# Altium schematic sheet MCU.SchDoc
size Letter
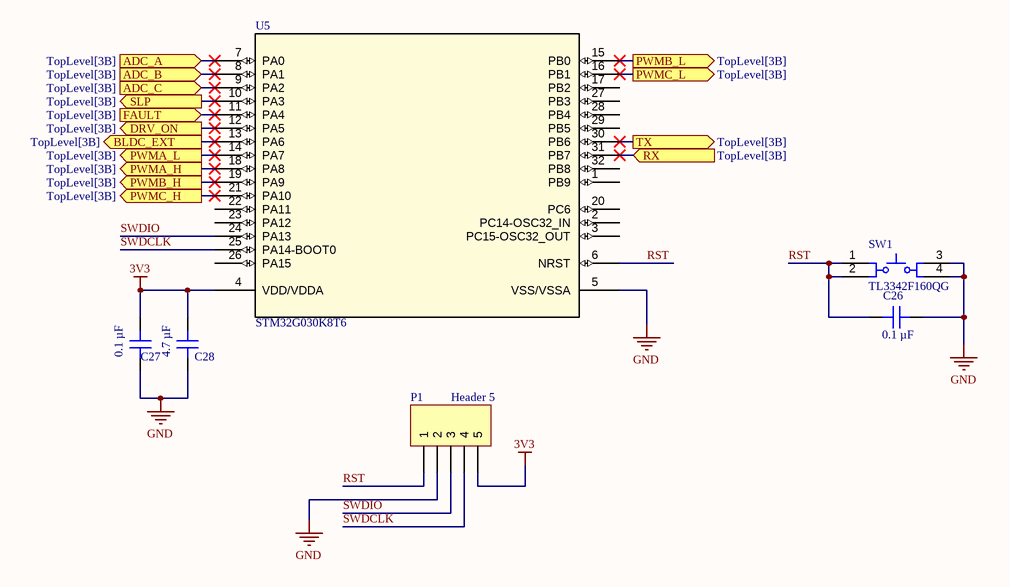
[diagram p0: MCU.SchDoc]

## Parts
C26  0.1 µF  [CAP 0805_2012]
C27  0.1 µF  [CAP 0805_2012]
C28  4.7 µF  [CAP 0805_2012]
P1  Header 5  [HDR1X5]
SW1  TL3342F160QG  [ESWI-TL3342F160QG_V]
U5  STM32G030K8T6  [LQFP-32]

## Ports
ADC_A (in, see TopLevel[3B]), ADC_B (in, see TopLevel[3B]), ADC_C (in, see TopLevel[3B]), BLDC_EXT (out, see TopLevel[3B]), DRV_ON (out, see TopLevel[3B]), FAULT (in, see TopLevel[3B]), PWMA_H (out, see TopLevel[3B]), PWMA_L (out, see TopLevel[3B]), PWMB_H (out, see TopLevel[3B]), PWMB_L (out, see TopLevel[3B]), PWMC_H (out, see TopLevel[3B]), PWMC_L (out, see TopLevel[3B]), RX (in, see TopLevel[3B]), SLP (out, see TopLevel[3B]), TX (out, see TopLevel[3B])

## Nets
3V3: C27.2 C28.2 P1.5 U5.4(VDD/VDDA)
GND: C26.1 C27.1 C28.1 P1.2 SW1.3 SW1.4 U5.5(VSS/VSSA)
ADC_A: U5.7(PA0) ; port ADC_A
ADC_B: U5.8(PA1) ; port ADC_B
ADC_C: U5.9(PA2) ; port ADC_C
BLDC_EXT: U5.13(PA6) ; port BLDC_EXT
DRV_ON: U5.12(PA5) ; port DRV_ON
FAULT: U5.11(PA4) ; port FAULT
PWMA_H: U5.18(PA8) ; port PWMA_H
PWMA_L: U5.14(PA7) ; port PWMA_L
PWMB_H: U5.19(PA9) ; port PWMB_H
PWMB_L: U5.15(PB0) ; port PWMB_L
PWMC_H: U5.21(PA10) ; port PWMC_H
PWMC_L: U5.16(PB1) ; port PWMC_L
RST: C26.2 P1.1 SW1.1 SW1.2 U5.6(NRST)
RX: U5.31(PB7) ; port RX
SLP: U5.10(PA3) ; port SLP
SWDCLK: P1.4 U5.25(PA14-BOOT0)
SWDIO: P1.3 U5.24(PA13)
TX: U5.30(PB6) ; port TX

Not connected (* = marked no-connect by the designer): U5 1(PB9) 2(PC14-OSC32_IN) 3(PC15-OSC32_OUT) 17(PB2) 20(PC6) 22(PA11) 23(PA12) 26(PA15) 27(PB3) 28(PB4) 29(PB5) 32(PB8)

## Notes on the sheet
- DWG. NO.
- REV.
- SHT.
- REVISION
- DESCRIPTION
- DATE
- APPROVED
- THIS DOCUMENT AND THE DATA DISCLOSED HEREIN OR HEREWITH IS THE PROPERTY OF ALTIUM LIMITED AND MAY BE FREELY DISTRIBUTED IN WHOLE. NO RIGHTS ARE RESERVED OR EXPRESS OR IMPLIED WARANTEE GIVEN.
- ENG:
- DSN:
- APPROVALS
- PROJECT
- DOCUMENT REVISION:
- DESIGN ITEM:
- CHK:
- BOM:
- REFERENCE DOCUMENTS
- PROJECT REVISION:
- TITLE
- FAB DWG:
- PCB DWG:
- ASSY DWG:
- SCALE:
- SIZE
- C
- CAGE CODE
- FILE NAME
- DWG NO.
- SHEET
- OF
- REV

## Library data of the parts
C26 C27 = CC0805KRX7R7BB104: CAP CER 0.1UF 16V X7R 0805; manufacturer: Yageo; Tolerance: ±10%; Part Number: CC0805KRX7R7BB104; Capacitance: 0.1 µF; Applications: General Purpose; componentlink1description: Datasheet; componentlink1url: https://www.yageo.com/upload/media/product/productsearch/datasheet/mlcc/UPY-GPHC_X7R_6.3V-to-50V_18.pdf; componentlink2description: DigiKey Link; componentlink2url: https://www.digikey.com/en/products/detail/yageo/CC0805KRX7R7BB104/302876; Device Package: 0805 (2012 Metric); Features: High Voltage; lastupdated: 2024-02-09 20:15:42; Lifecycle Status: Active; Minimum Order: 1; Mounting Type: Surface Mount, MLCC; Operating Temperature: -55°C ~ 125°C; Package / Case: 0805 (2012 Metric); packaging: TapeAndReel; partid: 12765; Part Status: Active; price: 0.01; series: CC; Size / Dimension: 0.079" L x 0.049" W (2.00mm x 1.25mm); Supplier 1: DigiKey; Supplier Part Number 1: 311-1142-1-ND; Temperature Coefficient: X7R; Thickness (Max): 0.033" (0.85mm); value: 0.1 µF; Voltage - Rated: 16V
C28 = CC0805KRX5R6BB475: CAP CER 4.7UF 10V X5R 0805; manufacturer: Yageo; Tolerance: ±10%; Part Number: CC0805KRX5R6BB475; Capacitance: 4.7 µF; Applications: General Purpose; componentlink1description: Datasheet; componentlink1url: https://www.yageo.com/upload/media/product/productsearch/datasheet/mlcc/UPY-GPHC_X5R_4V-to-50V_25.pdf; componentlink2description: DigiKey Link; componentlink2url: https://www.digikey.com/en/products/detail/yageo/CC0805KRX5R6BB475/5884183; Device Package: 0805 (2012 Metric); lastupdated: 2024-02-09 20:15:46; Lifecycle Status: Active; Minimum Order: 1; Mounting Type: Surface Mount, MLCC; Operating Temperature: -55°C ~ 85°C; Package / Case: 0805 (2012 Metric); packaging: TapeAndReel; partid: 11449; Part Status: Active; price: 0.07; series: CC; Size / Dimension: 0.079" L x 0.049" W (2.00mm x 1.25mm); Supplier 1: DigiKey; Supplier Part Number 1: 311-3426-1-ND; Temperature Coefficient: X5R; Thickness (Max): 0.057" (1.45mm); value: 4.7 µF; Voltage - Rated: 10V
P1 = Header 5: Header, 5-Pin; LatestRevisionDate: 17-Jul-2002; LatestRevisionNote: Re-released for DXP Platform.; Publisher: Altium Limited
SW1 = TL3342F160QG: Switch, Tactile, SPST-NO, 50 mA, 12 V, 4-Pin SMD, RoHS, Tape and Reel; Tolerance: 20%; Voltage Rating (DC): 50 V; Case\Package: Radial; Capacitance: 4.7 uF; RoHSCompliant: true; Min Operating Temperature: -40 degC; Width: 0 inch; Max Operating Temperature: 85 degC; ComponentLink1Description: Manufacturer URL; ComponentLink2Description: Datasheet; DatasheetVersion: Rev. I, 12/2010; ComponentLink1URL: http://www.e-switch.ch/en/; ComponentLink2URL: http://spec_sheets.e-switch.com/specs/P010632.pdf; PackageReference: TL3342F160QG; Pins: 2; Voltage Rating: 50 V; Mount: Through Hole; Length: 11 mm; REACH SVHC: No SVHC; Radiation Hardening: No; Lead Pitch: 2 mm; Diameter: 5 mm; Package Quantity: 200; Height: 11 mm; Packaging: Bulk; PackageDescription: 4-Pin Surface Mount Device, Body 5 x 5 mm, Pitch 6.3 mm; PartNumber: TL3342F160QG
U5 = STM32G030K8T6: No Description Available; Mfr_Name: STMicroelectronics; RefDes: RefDes; Type: Type